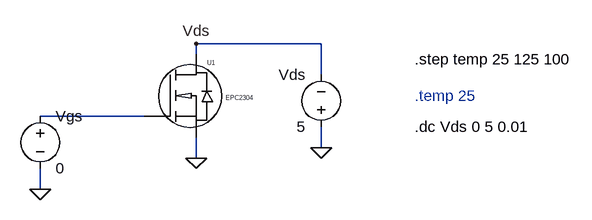
[diagram p0: schematic 00_FET_static_circuit.asc]
00_FET_static_circuit.asc, the LTspice schematic file:
Version 4.1
SHEET 1 936 680
WIRE 368 80 176 80
WIRE 176 96 176 80
WIRE 368 128 368 80
WIRE 96 192 -64 192
WIRE 368 240 368 208
WIRE 176 256 176 224
WIRE -64 304 -64 272
FLAG 176 256 0
FLAG -64 304 0
FLAG 176 80 Vds
FLAG 368 240 0
SYMBOL EPCGaN 96 192 R0
SYMATTR InstName U1
SYMATTR Value EPC2304
SYMBOL voltage -64 176 R0
WINDOW 123 0 0 Left 0
WINDOW 39 0 0 Left 0
SYMATTR InstName Vgs
SYMATTR Value 0
SYMBOL voltage 368 224 R180
WINDOW 0 24 96 Left 2
WINDOW 3 24 16 Left 2
SYMATTR InstName Vds
SYMATTR Value 5
TEXT 512 208 Left 2 !.dc Vds 0 5 0.01
TEXT 512 160 Left 2 ;.temp 25
TEXT 512 104 Left 2 !.step temp 25 125 100

The netlist it stands for:
* 00_FET_static_circuit.asc
X§U1 N001 Vds 0 EPC2304  ; pins gatein drainin sourcein
Vgs N001 0 0
Vds 0 Vds 5
.dc Vds 0 5 0.01
* .temp 25
.step temp 25 125 100
.lib EPCGanlibrary.lib
.backanno
.end